# Altium schematic sheet Variable Output 1.SchDoc
size A4
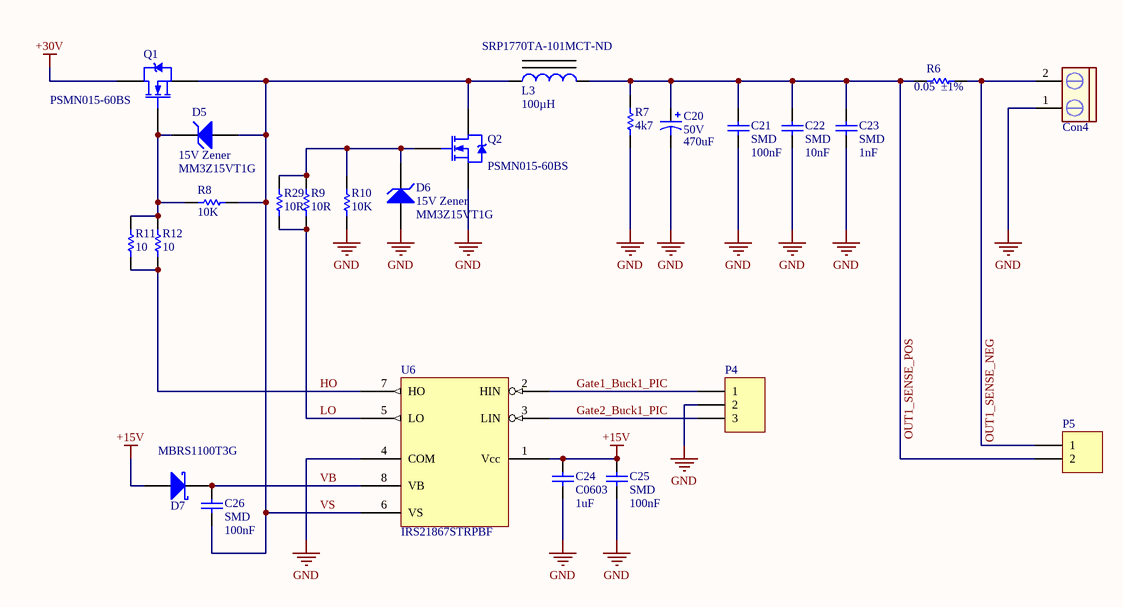
[diagram p0: Variable Output 1.SchDoc]

## Parts
C20  50V  value 470uF  [CAPPR5-10X20]
C21  SMD  value 100nF  [1206]
C22  SMD  value 10nF  [1206]
C23  SMD  value 1nF  [1206]
C24  C0603  value 1uF  [0603]
C25  SMD  value 100nF  [1206]
C26  SMD  value 100nF  [1206]
Con4  Salida Buck  [My_CN2]  (value not drawn)
D5  15V Zener  Manufacturer Part Number: MM3Z15VT1G  [SOD323]
D6  15V Zener  Manufacturer Part Number: MM3Z15VT1G  [SOD323]
D7  MBRS1100T3G  [SMB]
L3  Supplier Part Number: SRP1770TA-101MCT-ND  Inductance: 100µH  [SRP1770TA Series]  (hidden comment: Ferrite Inductor)
P4  Header 3  [My_1X03]  (value not drawn)
P5  Header 2  [My_1X02]  (value not drawn)
Q1  Manufacturer Part Number: PSMN015-60BS  [D2PAK_N]  (hidden comment: SUM110P06)
Q2  Manufacturer Part Number: PSMN015-60BS  [D2PAK_N]  (hidden comment: SUM110P06)
R6  Resistance (Ohms): 0.05  Tolerance: ±1%  [L1W-2512]  (hidden comment: ERJL1W)
R7  value 4k7  [8RB-1206]  (hidden comment: SMD)
R8  10K  [ERA-0603]
R9  10R  [ERA-0603]
R10  10K  [ERA-0603]
R11  10  [ERA-0603]
R12  10  [ERA-0603]
R29  10R  [ERA-0603]
U6  Manufacturer Part Number: IRS21867STRPBF  [SOIC8]  (hidden comment: IRS21867S)

## Nets
+15V: C24.2 C25.2 D7.1(A) U6.1(Vcc)
+30V: Q1.2(D)
GND: C20.2 C21.1 C22.1 C23.1 C24.1 C25.1 Con4.1 D6.1(A) P4.2 Q2.3(S) R7.1 R10.1 U6.4(COM)
Gate1_Buck1_PIC: P4.1 U6.2(HIN)
Gate2_Buck1_PIC: P4.3 U6.3(LIN)
HO: R11.1 R12.1 U6.7(HO)
LO: R9.1 R29.1 U6.5(LO)
OUT1_SENSE_NEG: Con4.2 P5.1 R6.2
OUT1_SENSE_POS: C20.1 C21.2 C22.2 C23.2 L3.2 P5.2 R6.1 R7.2
VB: C26.2 D7.2(K) U6.8(VB)
VS: C26.1 D5.1(A) L3.1 Q1.3(S) Q2.2(D) R8.2 U6.6(VS)
NetD5_2: D5.2(K) Q1.1(G) R8.1 R11.2 R12.2
NetD6_2: D6.2(K) Q2.1(G) R9.2 R10.2 R29.2

## Library data of the parts
C20 = EKB00DE347H00: Aluminum Electrolytic Capacitor, Radial Style with Long Leads: 470uF, 50V; Note: Refer to Manufacturer's Data Sheets for other lead formations; DrillSize: Nominal, Rounded To The Nearest 0.1mm; Published: 19-Mar-2004; DatasheetDocument: 21-Feb-2001; PackageReference: CAPPR5-10X20; Publisher: Altium Limited; ComponentLink1Description: Manufacturer Link; ComponentLink1URL: http://www.vishay.com/; ComponentLink2Description: Datasheet; ComponentLink2URL: http://www.vishay.com/docs/25013/ekb.pdf
C21-C23 C25 C26 = C1206: Ceramic Chip Capacitor - Standard; Published: 17-Jul-2002; LatestRevisionDate: 19-Mar-2004; LatestRevisionNote: Silkscreen size reduced.; DatasheetDocument: Mar-2001; PackageDocument: Mar-2001; PackageReference: 1206; Publisher: Altium Limited; Code_JEITA: 1206; Code_IPC: 3216 [1206]; ComponentLink1Description: Manufacturer Link; ComponentLink1URL: http://www.kemet.com/; ComponentLink2Description: Datasheet; ComponentLink2URL: http://www.kemet.com/kemet/web/homepage/kechome.nsf/vapubfilesname/F3102TA.pdf/$file/F3102TA.pdf
C24 = C0603: C1608X7R1C105K X7R; Note: Footprint corresponds to dimensions for bulk cassette packaging. This case size has tightened tolerances.; Published: 17-Jul-2002; LatestRevisionDate: 19-Mar-2004; LatestRevisionNote: Silkscreen size reduced.; DatasheetDocument: Mar-2001; PackageDocument: Mar-2001; PackageReference: 0603; Publisher: Altium Limited; Code_JEITA: 0603; Code_IPC: 1608 [0603]; ComponentLink1Description: Manufacturer Link; ComponentLink1URL: http://www.kemet.com/; ComponentLink2Description: Datasheet; ComponentLink2URL: http://www.kemet.com/kemet/web/homepage/kechome.nsf/vapubfilesname/F3102TA.pdf/$file/F3102TA.pdf
Con4 = CON2 pin blue: Connector blue screw
D5 D6 = D Zener: Zener Diode; Manufacturer: ON Semiconductor; Current - Reverse Leakage @ Vr: 50nA @ 10.5V; Voltage - Forward (Vf) (Max) @ If: 900mV @ 10mA; Tolerance: ±5%; Power - Max: 300mW; Packaging: Cut Tape (CT); Operating Temperature: -65°C ~ 150°C; Supplier Device Package: SOD-323; Mounting Type: Surface Mount; Supplier: Digi-Key; Supplier Part Number: MM3Z15VT1GOSCT-ND; RoHS: RoHS Compliant; Package / Case: SC-76, SOD-323; Category: Discrete Semiconductor Products; Part Status: Active
D7 = Generic Schottky Diode
L3 = Ferrite Inductor: Manufacturer Part Number: SRP1770TA-101M; Manufacturer: Bourns Inc.; Value: 100uH; Tolerance: ±20%; Type: Wirewound; DC Resistance (DCR): 118 mOhm Max; Current Rating: 5.3A; Current - Saturation: 6.5A; Shielding: Shielded; Material - Core: Carbonyl Powder; Frequency - Self Resonant: 2MHz; Q @ Freq: 20 @ 100kHz; Supplier Device Package: -; Package / Case: Nonstandard; Operating Temperature: -40°C ~ 150°C; Mounting Type: Surface Mount; Height - Seated (Max): 0.276" (7.00mm); Size / Dimension: 0.666" L x 0.666" W (16.90mm x 16.90mm); Part Status: Active; Ratings: AEC-Q200; Category: Inductors, Coils, Chokes; Packaging: Cut Tape (CT); RoHS: RoHS Compliant; Supplier: Digi-Key
P4 = Header 3: Header, 3-Pin; LatestRevisionDate: 17-Jul-2002; LatestRevisionNote: Re-released for DXP Platform.; Publisher: Altium Limited
P5 = Header 2: Header, 2-Pin; LatestRevisionDate: 17-Jul-2002; LatestRevisionNote: Re-released for DXP Platform.; Publisher: Altium Limited
Q1 Q2 = IRF540NS: HEXFET Power MOSFET; Manufacturer: Vishay Siliconix; Vgs (Max): ±20V; Rds On (Max) @ Id, Vgs: 6.9 mOhm @ 30A, 10V; Vgs(th) (Max) @ Id: 3V @ 250µA; Power Dissipation (Max): 3.75W (Ta), 375W (Tc); Input Capacitance (Ciss) (Max) @ Vds: 11400pF @ 25V; Gate Charge (Qg) (Max) @ Vgs: 345nC @ 10V; Current - Continuous Drain (Id) @ 25°C: 110A (Tc); Drive Voltage (Max Rds On,  Min Rds On): 4.5V, 10V; FET Type: P-Channel; Drain to Source Voltage (Vdss): 60V; Supplier Device Package: TO-263 (D2Pak); FET Feature: -; Mounting Type: Surface Mount; Package / Case: TO-263-3, D²Pak (2 Leads + Tab), TO-263AB; Operating Temperature: -55°C ~ 175°C (TJ); Supplier: Digi-Key; Packaging: Cut Tape (CT); Category: Discrete Semiconductor Products; RoHS: RoHS Compliant; Technology: MOSFET (Metal Oxide); Part Status: Active; Supplier Part Number: SUM110P06-07L-E3CT-ND
R6 = ERJL1W: Low Ohmic Value Thick Film Chip Resistor, 40m Ohm to 100m Ohm Range, 1% and 5% Tolerance, 2512 Size, 1 W; Manufacturer Part Number: PE2512FKE070R05L; Manufacturer: Yageo; Power (Watts): 1W; Temperature Coefficient: ±50ppm/°C; Published: 17-Dec-2003; LatestRevisionDate: 19-Mar-2004; LatestRevisionNote: Silkscreen size reduced.; PackageDocument: Mar-2003; PackageReference: L1W-2512; Publisher: Altium Limited; ComponentLink1Description: Manufacturer Link; ComponentLink1URL: http://www.panasonic.com/industrial/components/resistive_products.htm; ComponentLink2Description: Datasheet; ComponentLink2URL: http://www.panasonic.com/industrial/components/pdf/AOA0000CE3.pdf; Features: Automotive AEC-Q200, Current Sense, Moisture Resistant; Supplier: Digi-Key; Package / Case: 2512 (6432 Metric); RoHS: RoHS Compliant; Height - Seated (Max): 0.035" (0.89mm); Size / Dimension: 0.250" L x 0.125" W (6.35mm x 3.18mm); Supplier Device Package: 2512; Part Status: Active; Packaging: Cut Tape (CT); Operating Temperature: -55°C ~ 170°C; Composition: Metal Film; Category: Resistors; Failure Rate: -; Supplier Part Number: YAG2156CT-ND
R7 = ERJ8BQ: Low Ohmic Value Thick Film Chip Resistor, 0.22 Ohm to 9.1 Ohm Range, 1%, 2% and 5% Tolerance, 1206 Size, 0.33 W; Published: 17-Dec-2003; LatestRevisionDate: 19-Mar-2004; LatestRevisionNote: Silkscreen size reduced.; PackageDocument: Mar-2003; PackageReference: 8RB-1206; Publisher: Altium Limited; Code_IPC: 3216 [1206]; ComponentLink1Description: Manufacturer Link; ComponentLink1URL: http://www.panasonic.com/industrial/components/resistive_products.htm; ComponentLink2Description: Datasheet; ComponentLink2URL: http://www.panasonic.com/industrial/components/pdf/AOA0000CE3.pdf
R8-R12 R29 = ERA3Y: Rectangular Thick Film Chip Resistor, 10 Ohm to 330k Ohm Range, 0.1% and 0.5% Tolerance, 0603 Size, 0.063 W; Note: If flow soldering, adjust pad width of PCB Footprint to 0.7 - 0.8 times the width of the resistor.; Published: 17-Dec-2003; LatestRevisionDate: 19-Mar-2004; LatestRevisionNote: Silkscreen size reduced.; PackageDocument: Mar-2003; PackageReference: ERA-0603; Publisher: Altium Limited; Code_IPC: 1608 [0603]; ComponentLink1Description: Manufacturer Link; ComponentLink1URL: http://www.panasonic.com/industrial/components/resistive_products.htm; ComponentLink2Description: Datasheet; ComponentLink2URL: http://www.panasonic.com/industrial/components/pdf/AOA0000CE8.pdf
U6 = IRS21867S: Half-Bridge Gate Driver IC Inverting 8-SOIC; Manufacturer: Infineon Technologies; Gate Type: IGBT, N-Channel MOSFET; Current - Peak Output (Source, Sink): 4A, 4A; Voltage - Supply: 10 V ~ 20 V; Rise / Fall Time (Typ): 22ns, 18ns; Channel Type: Independent; Logic Voltage - VIL, VIH: 0.8V, 2.5V; Part Status: Active; Supplier: Digi-Key; Supplier Device Package: 8-SOIC; Package / Case: 8-SOIC (0.154", 3.90mm Width); Mounting Type: Surface Mount; Operating Temperature: -40°C ~ 150°C (TJ); Packaging: Cut Tape (CT); Input Type: Inverting; Category: Integrated Circuits (ICs); RoHS: RoHS Compliant; Driven Configuration: Half-Bridge; Supplier Part Number: IRS21867STRPBFCT-ND